# EAGLE design controller_rev2 (EAGLE 9.0.0)

## Sheet 1 of 3
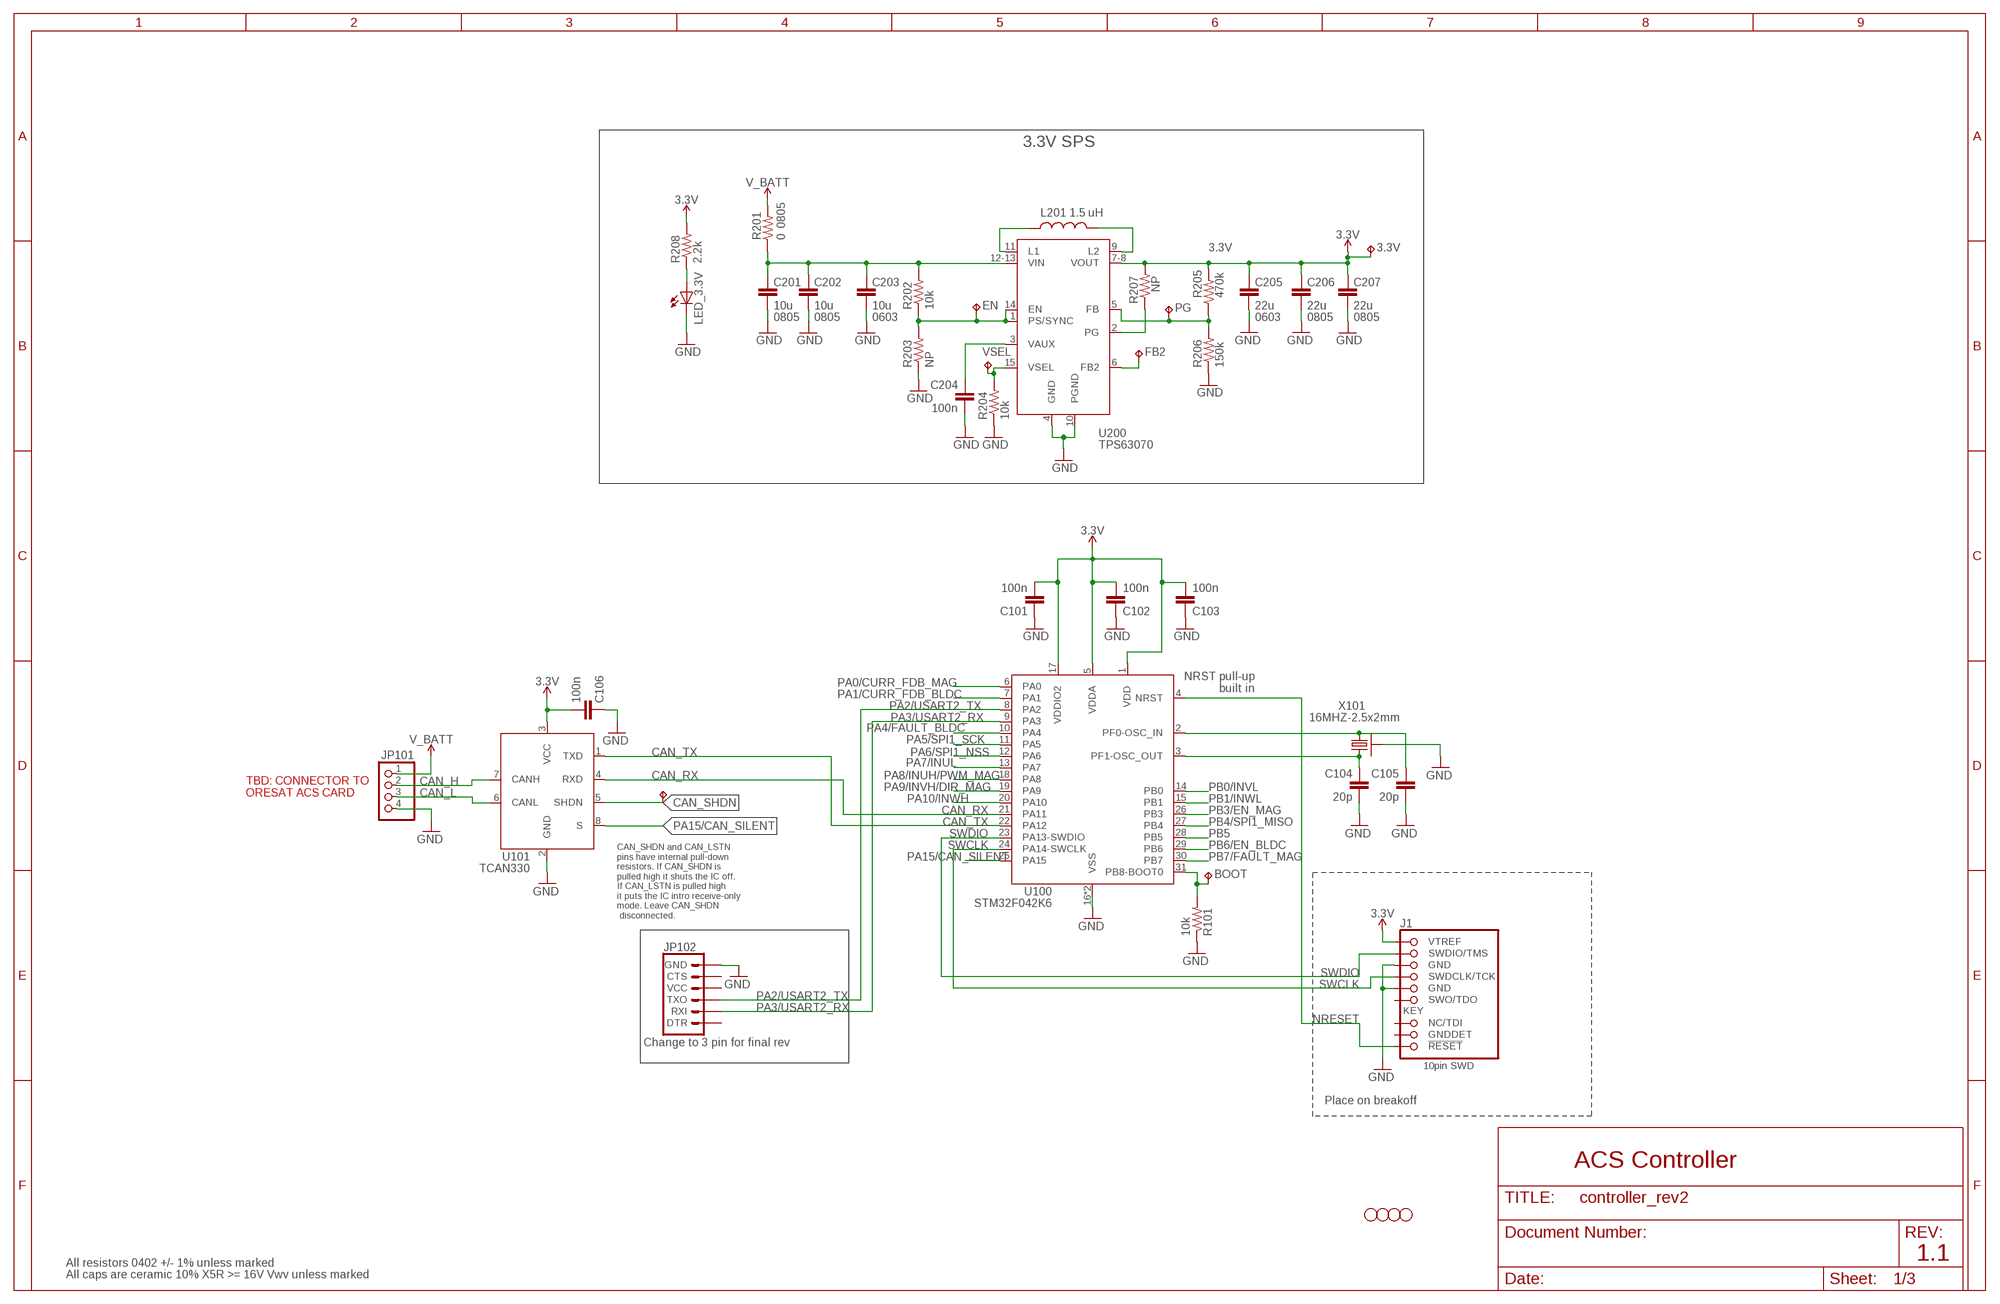
[diagram p0: schematic, sheet 1]

### Parts
3.3V  TPTP15SQ  [TP15SQ]
BOOT  TPTP15SQ  [TP15SQ]
BOOT1  TPTP15SQ  [TP15SQ]
C101  100n  C-EU0402-B-NOSILK  [.0402-B-NOSILK]
C102  100n  C-EU0402-B-NOSILK  [.0402-B-NOSILK]
C103  100n  C-EU0402-B-NOSILK  [.0402-B-NOSILK]
C104  20p  C-EU0402-B-NOSILK  [.0402-B-NOSILK]
C105  20p  C-EU0402-B-NOSILK  [.0402-B-NOSILK]
C106  100n  C-EU0402-B-NOSILK  [.0402-B-NOSILK]
C201  10u  C-EU0805-B-NOSILK  [.0805-B-NOSILK]
C202  10u  C-EU0805-B-NOSILK  [.0805-B-NOSILK]
C203  10u  C-EU0603-B-NOSILK  [.0603-B-NOSILK]
C204  100n  C-EU0402-B-NOSILK  [.0402-B-NOSILK]
C205  22u  C-EU0603-B-NOSILK  [.0603-B-NOSILK]
C206  22u  C-EU0805-B-NOSILK  [.0805-B-NOSILK]
C207  22u  C-EU0805-B-NOSILK  [.0805-B-NOSILK]
EN  TPTP15SQ  [TP15SQ]
FB2  TPTP15SQ  [TP15SQ]
H1  STAND-OFFTIGHT  [STAND-OFF-TIGHT]
H2  STAND-OFFTIGHT  [STAND-OFF-TIGHT]
H3  STAND-OFFTIGHT  [STAND-OFF-TIGHT]
H4  STAND-OFFTIGHT  [STAND-OFF-TIGHT]
J1  1.27MM-SWD-CONNECTOR  [1.27MM_2X5]
JP101  PINHD-1X4  [1X04]
JP102  6_PIN_SERIAL_TARGETSILK  [6_PIN_SERIAL_TARGET_SIDE_W_SILK]
L201  1.5 uH  L-COILCRAFT-XFL4020  [L-COILCRAFT-XFL4020]
LED_3.3V  LEDCHIPLED_0603  [CHIPLED_0603]
PG  TPTP15SQ  [TP15SQ]
R101  10k  R-US_0402-B-NOSILK  [.0402-B-NOSILK]
R201  0  R-US_0805-B-NOSILK  [.0805-B-NOSILK]
R202  10k  R-US_0402-B-NOSILK  [.0402-B-NOSILK]
R203  NP  R-US_0402-B-NOSILK  [.0402-B-NOSILK]
R204  10k  R-US_0402-B-NOSILK  [.0402-B-NOSILK]
R205  470k  R-US_0402-B-NOSILK  [.0402-B-NOSILK]
R206  150k  R-US_0402-B-NOSILK  [.0402-B-NOSILK]
R207  NP  R-US_0402-B-NOSILK  [.0402-B-NOSILK]
R208  2.2k  R-US_0603-B-NOSILK  [.0603-B-NOSILK]
U100  STM32F042K6  [QFP32-7X7]
U101  TCAN330  [SOT23-8_TI-DCN]
U200  TPS63070  TPS63070X  [TPS63070X]
VSEL  TPTP15SQ  [TP15SQ]
X101  16MHZ-2.5x2mm  CRYSTAL-WITH-GND  [CRYSTAL_2.5X2]

### Nets
3.3V: 3.3V.TP C101.2 C102.2 C103.2 C106.2 C205.1 C206.1 C207.1 J1.VTREF R205.2 R207.2 R208.2 U100.1(VDD) U100.5(VDDA) U100.17(VDDIO2) U101.3(VCC) U200.7-8(VOUT) ; also sheet 2,3
BOOT: BOOT.TP R101.2 U100.31(PB8-BOOT0)
CAN_H: JP101.2 U101.7(CANH)
CAN_L: JP101.3 U101.6(CANL)
CAN_RX: U100.21(PA11) U101.4(RXD)
CAN_SHDN: BOOT1.TP U101.5(SHDN)
CAN_TX: U100.22(PA12) U101.1(TXD)
CRYSTALIN: C105.1 U100.2(PF0-OSC_IN) X101.1
CRYSTALOUT: C104.1 U100.3(PF1-OSC_OUT) X101.3
GND: C101.1 C102.1 C103.1 C104.2 C105.2 C106.1 C201.2 C202.2 C203.2 C204.2 C205.2 C206.2 C207.2 J1.GND J1.GND@2(GND) JP101.4 JP102.P$6(GND) LED_3.3V.C R101.1 R203.1 R204.1 R206.1 U100.16(VSS) U100.32(VSS) U101.2(GND) U200.4(GND) U200.10(PGND) X101.2(SHIELD) X101.4(SHIELD) ; also sheet 2,3
N$20: LED_3.3V.A R208.1
NRESET: J1.!RESET U100.4(NRST)
PA0/CURR_FDB_MAG: U100.6(PA0) ; also sheet 3
PA1/CURR_FDB_BLDC: U100.7(PA1) ; also sheet 2
PA2/USART2_TX: JP102.P$2(TXO) U100.8(PA2)
PA3/USART2_RX: JP102.P$3(RXI) U100.9(PA3)
PA4/FAULT_BLDC: U100.10(PA4) ; also sheet 2
PA5/SPI1_SCK: U100.11(PA5) ; also sheet 2
PA6/SPI1_NSS: U100.12(PA6) ; also sheet 2
PA7/INUL: U100.13(PA7) ; also sheet 2
PA8/INUH/PWM_MAG: U100.18(PA8) ; also sheet 2,3
PA9/INVH/DIR_MAG: U100.19(PA9) ; also sheet 2,3
PA10/INWH: U100.20(PA10) ; also sheet 2
PA15/CAN_SILENT: U100.25(PA15) U101.8(S)
PB0/INVL: U100.14(PB0) ; also sheet 2
PB1/INWL: U100.15(PB1) ; also sheet 2
PB3/EN_MAG: U100.26(PB3) ; also sheet 3
PB4/SPI1_MISO: U100.27(PB4) ; also sheet 2
PB5: U100.28(PB5)
PB6/EN_BLDC: U100.29(PB6) ; also sheet 2
PB7/FAULT_MAG: U100.30(PB7) ; also sheet 3
SWCLK: J1.SWDCLK(SWDCLK/TCK) U100.24(PA14-SWCLK)
SWDIO: J1.SWDIO(SWDIO/TMS) U100.23(PA13-SWDIO)
TPS-EN: EN.TP R202.1 R203.2 U200.1(PS/SYNC) U200.14(EN)
TPS-FB: PG.TP R205.1 R206.2 U200.5(FB)
TPS-L1: L201.1 U200.11(L1)
TPS-L2: L201.2 U200.9(L2)
TPS-PG: R207.1 U200.2(PG)
TPS-VAUX: C204.1 U200.3(VAUX)
TPS-VIN: C201.1 C202.1 C203.1 R201.1 R202.2 U200.12-13(VIN)
TSP-FB2: FB2.TP U200.6(FB2)
TSP-VSEL: R204.2 U200.15(VSEL) VSEL.TP
V_BATT: JP101.1 R201.2 ; also sheet 2,3
Unconnected: J1.GNDDET J1.NC(NC/TDI) J1.SWO(SWO/TDO) JP102.P$1(DTR) JP102.P$4(VCC) JP102.P$5(CTS)

### Notes on the sheet
- 3.3V SPS
- 0805
- 0805 | 0805 | 0603 | 0603 | 0805 | 0805
- NRST pull-up
  built in
- TBD: CONNECTOR TO 
  ORESAT ACS CARD
- CAN_SHDN and CAN_LSTN
  pins have internal pull-down
  resistors. If CAN_SHDN is 
  pulled high it shuts the IC off.
  If CAN_LSTN is pulled high
  it puts the IC intro receive-only
  mode. Leave CAN_SHDN
   disconnected.
- Change to 3 pin for final rev
- Place on breakoff
- ACS Controller
- 1.1
- All resistors 0402 +/- 1% unless marked
- All caps are ceramic 10% X5R >= 16V Vwv unless marked

## Sheet 2 of 3
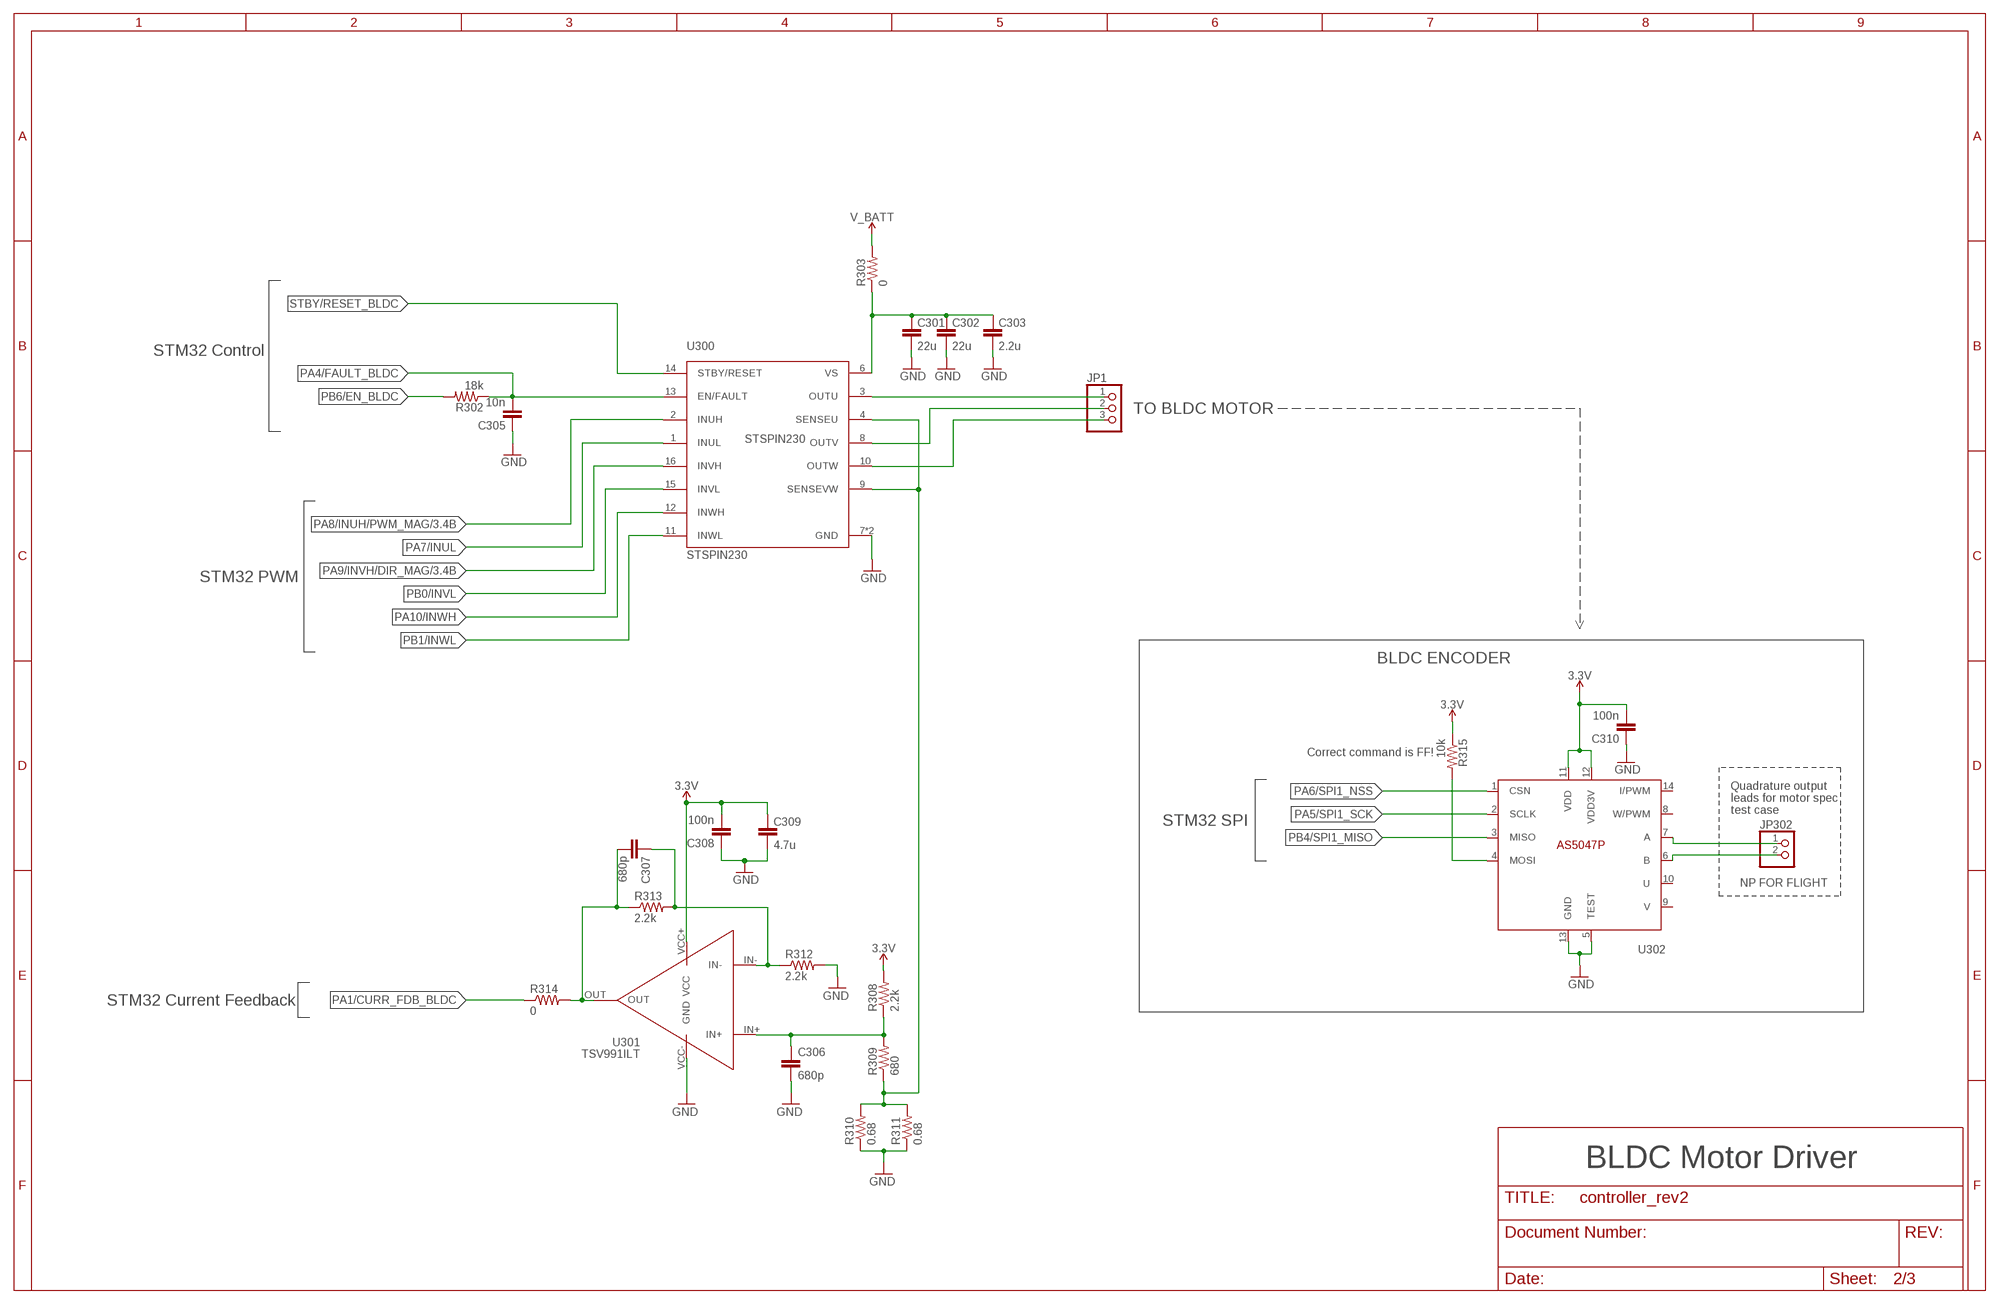
[diagram p1: schematic, sheet 2]

### Parts
C301  22u  C-EU0603-B-NOSILK  [.0603-B-NOSILK]
C302  22u  C-EU0603-B-NOSILK  [.0603-B-NOSILK]
C303  2.2u  C-EU0603-B-NOSILK  [.0603-B-NOSILK]
C305  10n  C-EU0402-B-NOSILK  [.0402-B-NOSILK]
C306  680p  C-EU0402-B-NOSILK  [.0402-B-NOSILK]
C307  680p  C-EU0402-B-NOSILK  [.0402-B-NOSILK]
C308  100n  C-EU0402-B-NOSILK  [.0402-B-NOSILK]
C309  4.7u  C-EU0603-B-NOSILK  [.0603-B-NOSILK]
C310  100n  C-EU0402-B-NOSILK  [.0402-B-NOSILK]
JP1  PINHD-1X3  [1X03]
JP302  PINHD-1X2  [1X02]
R302  18k  R-US_0402-B-NOSILK  [.0402-B-NOSILK]
R303  0  R-US_0805-B-NOSILK  [.0805-B-NOSILK]
R308  2.2k  R-US_0402-B-NOSILK  [.0402-B-NOSILK]
R309  680  R-US_0402-B-NOSILK  [.0402-B-NOSILK]
R310  0.68  R-US_0805-B-NOSILK  [.0805-B-NOSILK]
R311  0.68  R-US_0805-B-NOSILK  [.0805-B-NOSILK]
R312  2.2k  R-US_0402-B-NOSILK  [.0402-B-NOSILK]
R313  2.2k  R-US_0402-B-NOSILK  [.0402-B-NOSILK]
R314  0  R-US_0402-B-NOSILK  [.0402-B-NOSILK]
R315  10k  R-US_0402-B-NOSILK  [.0402-B-NOSILK]
U300  STSPIN230  [VFQFPN]
U301  TSV991ILT  [SOT23-5]
U302  AS5047P  [TSSOP14]

### Nets
3.3V: C308.2 C309.1 C310.2 R308.2 R315.1 U301.VCC+(VCC) U302.11(VDD) U302.12(VDD3V) ; also sheet 1,3
GND: C301.2 C302.2 C303.2 C305.1 C306.2 C308.1 C309.2 C310.1 R310.1 R311.1 R312.2 U300.7(GND) U300.EPAD(GND) U301.VCC-(GND) U302.5(TEST) U302.13(GND) ; also sheet 1,3
N$1: R315.2 U302.4(MOSI)
N$4: JP302.1 U302.7(A)
N$7: C301.1 C302.1 C303.1 R303.1 U300.6(VS)
N$13: JP302.2 U302.6(B)
N$14: C307.1 R312.1 R313.2 U301.IN-
N$16: C306.1 R308.1 R309.2 U301.IN+
N$29: C307.2 R313.1 R314.2 U301.OUT
PA1/CURR_FDB_BLDC: R314.1 ; also sheet 1
PA4/FAULT_BLDC: C305.2 R302.1 U300.13(EN/FAULT) ; also sheet 1
PA5/SPI1_SCK: U302.2(SCLK) ; also sheet 1
PA6/SPI1_NSS: U302.1(CSN) ; also sheet 1
PA7/INUL: U300.1(INUL) ; also sheet 1
PA8/INUH/PWM_MAG: U300.2(INUH) ; also sheet 1,3
PA9/INVH/DIR_MAG: U300.16(INVH) ; also sheet 1,3
PA10/INWH: U300.12(INWH) ; also sheet 1
PB0/INVL: U300.15(INVL) ; also sheet 1
PB1/INWL: U300.11(INWL) ; also sheet 1
PB4/SPI1_MISO: U302.3(MISO) ; also sheet 1
PB6/EN_BLDC: R302.2 ; also sheet 1
SENSE_BLDC: R309.1 R310.2 R311.2 U300.4(SENSEU) U300.9(SENSEVW)
STBY/RESET_BLDC: U300.14(STBY/RESET)
U: JP1.1 U300.3(OUTU)
V: JP1.2 U300.8(OUTV)
V_BATT: R303.2 ; also sheet 1,3
W: JP1.3 U300.10(OUTW)
Unconnected: U302.8(W/PWM) U302.9(V) U302.10(U) U302.14(I/PWM)

### Notes on the sheet
- STM32 Control
- TO BLDC MOTOR
- STM32 PWM
- BLDC ENCODER
- Correct command is FF!
- Quadrature output
  leads for motor spec
  test case
- STM32 SPI
- NP FOR FLIGHT
- STM32 Current Feedback
- BLDC Motor Driver

## Sheet 3 of 3
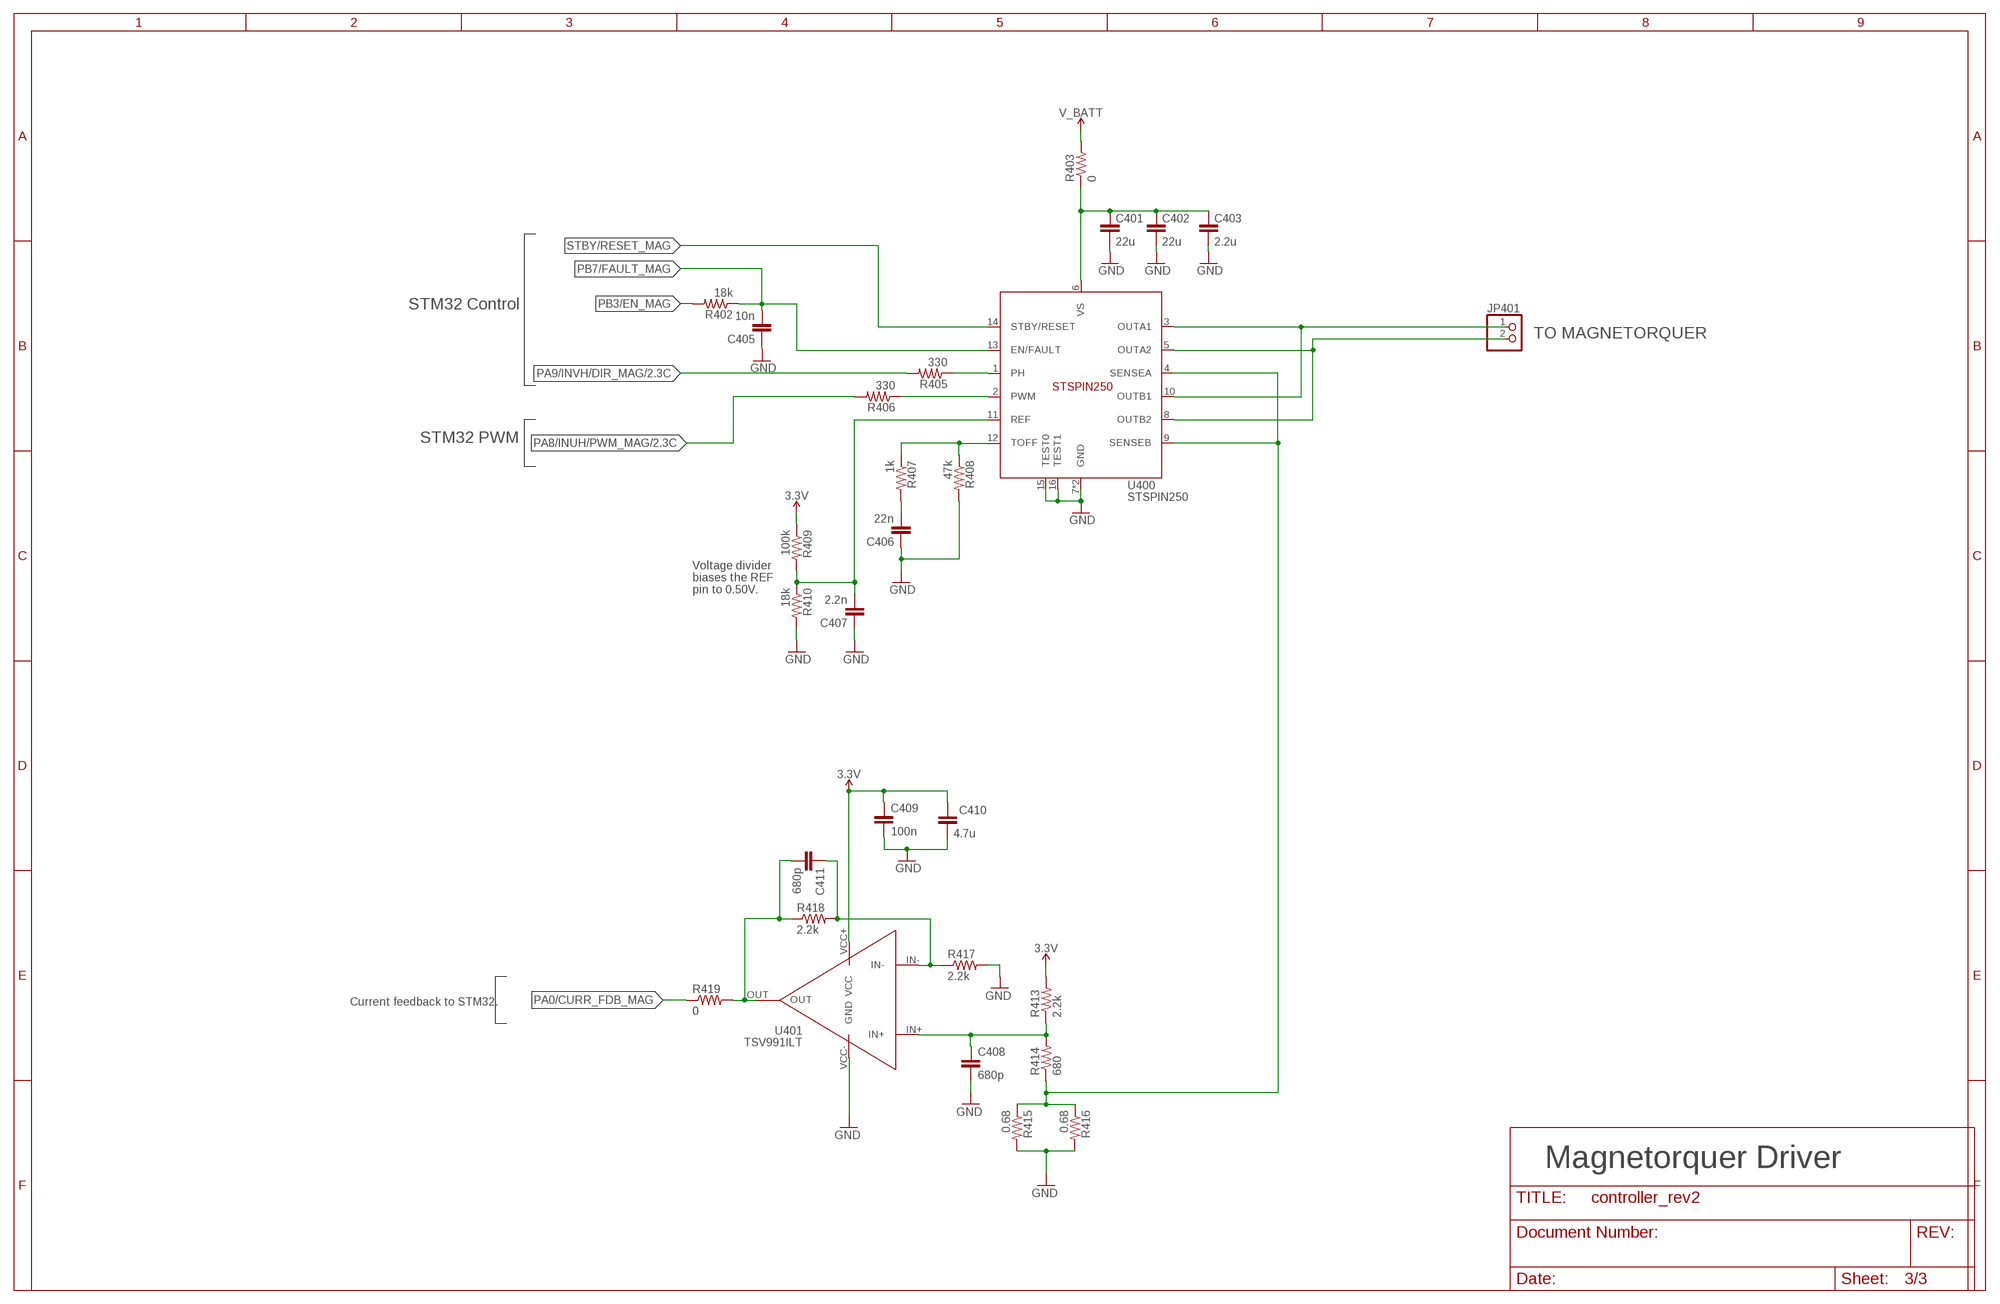
[diagram p2: schematic, sheet 3]

### Parts
C401  22u  C-EU0603-B-NOSILK  [.0603-B-NOSILK]
C402  22u  C-EU0603-B-NOSILK  [.0603-B-NOSILK]
C403  2.2u  C-EU0603-B-NOSILK  [.0603-B-NOSILK]
C405  10n  C-EU0402-B-NOSILK  [.0402-B-NOSILK]
C406  22n  C-EU0402-B-NOSILK  [.0402-B-NOSILK]
C407  2.2n  C-EU0402-B-NOSILK  [.0402-B-NOSILK]
C408  680p  C-EU0402-B-NOSILK  [.0402-B-NOSILK]
C409  100n  C-EU0402-B-NOSILK  [.0402-B-NOSILK]
C410  4.7u  C-EU0603-B-NOSILK  [.0603-B-NOSILK]
C411  680p  C-EU0402-B-NOSILK  [.0402-B-NOSILK]
JP401  PINHD-1X2  [1X02]
R402  18k  R-US_0402-B-NOSILK  [.0402-B-NOSILK]
R403  0  R-US_0805-B-NOSILK  [.0805-B-NOSILK]
R405  330  R-US_0402-B-NOSILK  [.0402-B-NOSILK]
R406  330  R-US_0402-B-NOSILK  [.0402-B-NOSILK]
R407  1k  R-US_0402-B-NOSILK  [.0402-B-NOSILK]
R408  47k  R-US_0402-B-NOSILK  [.0402-B-NOSILK]
R409  100k  R-US_0402-B-NOSILK  [.0402-B-NOSILK]
R410  18k  R-US_0402-B-NOSILK  [.0402-B-NOSILK]
R413  2.2k  R-US_0402-B-NOSILK  [.0402-B-NOSILK]
R414  680  R-US_0402-B-NOSILK  [.0402-B-NOSILK]
R415  0.68  R-US_0805-B-NOSILK  [.0805-B-NOSILK]
R416  0.68  R-US_0805-B-NOSILK  [.0805-B-NOSILK]
R417  2.2k  R-US_0402-B-NOSILK  [.0402-B-NOSILK]
R418  2.2k  R-US_0402-B-NOSILK  [.0402-B-NOSILK]
R419  0  R-US_0402-B-NOSILK  [.0402-B-NOSILK]
U400  STSPIN250  [VFQPN]
U401  TSV991ILT  [SOT23-5]

### Nets
3.3V: C409.1 C410.1 R409.1 R413.2 U401.VCC+(VCC) ; also sheet 1,2
GND: C401.2 C402.2 C403.2 C405.1 C406.1 C407.1 C408.2 C409.2 C410.2 R408.2 R410.2 R415.2 R416.2 R417.2 U400.7(GND) U400.15(TEST0) U400.16(TEST1) U400.EPAD(GND) U401.VCC-(GND) ; also sheet 1,2
N$2: C406.2 R407.2
N$3: R406.1 U400.2(PWM)
N$5: R405.1 U400.1(PH)
N$8: C401.1 C402.1 C403.1 R403.1 U400.6(VS)
N$15: C408.1 R413.1 R414.2 U401.IN+
N$17: C411.1 R417.1 R418.2 U401.IN-
N$19: R407.1 R408.1 U400.12(TOFF)
N$25: C407.2 R409.2 R410.1 U400.11(REF)
N$27: C411.2 R418.1 R419.2 U401.OUT
OUT1: JP401.1 U400.3(OUTA1) U400.10(OUTB1)
OUT2: JP401.2 U400.5(OUTA2) U400.8(OUTB2)
PA0/CURR_FDB_MAG: R419.1 ; also sheet 1
PA8/INUH/PWM_MAG: R406.2 ; also sheet 1,2
PA9/INVH/DIR_MAG: R405.2 ; also sheet 1,2
PB3/EN_MAG: R402.2 ; also sheet 1
PB7/FAULT_MAG: C405.2 R402.1 U400.13(EN/FAULT) ; also sheet 1
SENSE_MAG: R414.1 R415.1 R416.1 U400.4(SENSEA) U400.9(SENSEB)
STBY/RESET_MAG: U400.14(STBY/RESET)
V_BATT: R403.2 ; also sheet 1,2

### Notes on the sheet
- STM32 Control
- TO MAGNETORQUER
- STM32 PWM
- Voltage divider
  biases the REF
  pin to 0.50V.
- Current feedback to STM32.
- Magnetorquer Driver

## Library data of the parts
3.3V BOOT BOOT1 EN FB2 PG VSEL = testpad:TP: Test pad
C101-C103 C106 C204 C305-C308 C310 C405-C409 C411 = rcl_custom:C-EU: CAPACITOR, European symbol; DIS: Digi-Key; DPN: 1276-1001-1-ND; MFR: Samsung; MPN: CL05B104KO5NNNC
C104 C105 = rcl_custom:C-EU: CAPACITOR, European symbol; DIS: Digi-Key; DPN: 1276-6601-1-ND; MFR: Samsung; MPN: CL05C200JB51PNC
C201 C202 C206 C207 = oresat-rcl:C-EU: CAPACITOR, European symbol
C203 C205 C301-C303 C309 C401-C403 C410 = oresat-rcl:C-EU: CAPACITOR, European symbol; DIS: Digi-Key; DPN: 1276-1001-1-ND; MFR: Samsung; MPN: CL05B104KO5NNNC
H1-H4 = SparkFun-Hardware:STAND-OFF: Stand Off Drill holes for mechanically mounting via screws, standoffs, etc. Note: Use the keepout ring to avoid running the screw head into surrounding components. Variant Overviews STAND-OFF - Mechanical footprint for a #4 phillips button head screw. STAND-OFF-TIGHT - Mechanical footprint for a #4 phillips button head screw, Example SparkFun Products Screw - Phillips Head (1/4", 4-40, 10 pack) <https://www.sparkfun.com/products/10453> (PRT-10453) Screw - Phillips Head (1/2", 4-40, 10 pack) <https://www.sparkfun.com/products/10452> (PRT-10452) Screw - Phillips Head (3/4", 4-40, 10 pack) <https://www.sparkfun.com/products/10451> (PRT-10451) Screw - Phillips Head (1", 4-40, 10 pack) <https://www.sparkfun.com/products/10450> (PRT-10450)
J1 = J-CNC-3220-10-0100-00-ARM-SWD-port:1.27MM-SWD-CONNECTOR: ARM SWD Programming Header. Example part is the CNC 3220-10-0100-00
JP1 = pinhead:PINHD-1X3: PIN HEADER
JP101 = pinhead:PINHD-1X4: PIN HEADER
JP102 = SparkFun-Connectors:6_PIN_SERIAL_TARGET: 6-pin header connection for use with the "FTDI BASIC" pinout - TARGET SIDE. Also known as "Arduino Serial Program Header". It is used to mate with our FTDI Basic serial programmers using the Arduino IDE. Note, this device has "TARGET" in the name. It is intended to be used on a design that contains a target micro-controller that you wish to program. The "sister" device, named "CABLE" is inteneded to be used on a design that usually lives on the end of your USB cable and prvides the converter chip (FTDI232 or FTDI231x) to commnicate serial RX/TX. You can populate with some of these: Break Away Headers - Straight <https://www.sparkfun.com/products/116> (PRT-00116) For reference (or to suit your programming needs) check out these designs: SparkFun FTDI Basic Breakout - 5V <https://www.sparkfun.com/products/9716> (DEV-09716) SparkFun FTDI Basic Breakout - 3.3V <https://www.sparkfun.com/products/9873> (DEV-09873) SparkFun FTDI SmartBasic <https://www.sparkfun.com/products/12935> (DEV-12935) SparkFun Beefy 3 - FTDI Basic Breakout <https://www.sparkfun.com/products/13746> (DEV-13746)
JP302 JP401 = pinhead:PINHD-1X2: PIN HEADER
L201 = L-Coilcraft-XFL4020:L-COILCRAFT-XFL4020; DIS: Mouser; DPN: 994-XFL4020-152MEB; MFR: Coilcraft; MPN: XFL4020-152ME
LED_3.3V = led:LED: LED OSRAM: - CHIPLED LG R971, LG N971, LY N971, LG Q971, LY Q971, LO R971, LY R971 LH N974, LH R974 LS Q976, LO Q976, LY Q976 LO Q996 - Hyper CHIPLED LW Q18S LB Q993, LB Q99A, LB R99A - SideLED LS A670, LO A670, LY A670, LG A670, LP A670 LB A673, LV A673, LT A673, LW A673 LH A674 LY A675 LS A676, LA A676, LO A676, LY A676, LW A676 LS A679, LY A679, LG A679 - Hyper Micro SIDELED® LS Y876, LA Y876, LO Y876, LY Y876 LT Y87S - SmartLED LW L88C, LW L88S LB L89C, LB L89S, LG L890 LS L89K, LO L89K, LY L89K LS L896, LA L896, LO L896, LY L896 - TOPLED LS T670, LO T670, LY T670, LG T670, LP T670 LSG T670, LSP T670, LSY T670, LOP T670, LYG T670 LG T671, LOG T671, LSG T671 LB T673, LV T673, LT T673, LW T673 LH T674 LS T676, LA T676, LO T676, LY T676, LB T676, LH T676, LSB T676, LW T676 LB T67C, LV T67C, LT T67C, LS T67K, LO T67K, LY T67K, LW E67C LS E67B, LA E67B, LO E67B, LY E67B, LB E67C, LV E67C, LT E67C LW T67C LS T679, LY T679, LG T679 LS T770, LO T770, LY T770, LG T770, LP T770 LB T773, LV T773, LT T773, LW T773 LH T774 LS E675, LA E675, LY E675, LS T675 LS T776, LA T776, LO T776, LY T776, LB T776 LHGB T686 LT T68C, LB T68C - Hyper Mini TOPLED® LB M676 - Mini TOPLED Santana® LG M470 LS M47K, LO M47K, LY M47K Source: http://www.osram.convergy.de LUXEON: - LUMILED® LXK2-PW12-R00, LXK2-PW12-S00, LXK2-PW14-U00, LXK2-PW14-V00 LXK2-PM12-R00, LXK2-PM12-S00, LXK2-PM14-U00 LXK2-PE12-Q00, LXK2-PE12-R00, LXK2-PE12-S00, LXK2-PE14-T00, LXK2-PE14-U00 LXK2-PB12-K00, LXK2-PB12-L00, LXK2-PB12-M00, LXK2-PB14-N00, LXK2-PB14-P00, LXK2-PB14-Q00 LXK2-PR12-L00, LXK2-PR12-M00, LXK2-PR14-Q00, LXK2-PR14-R00 LXK2-PD12-Q00, LXK2-PD12-R00, LXK2-PD12-S00 LXK2-PH12-R00, LXK2-PH12-S00 LXK2-PL12-P00, LXK2-PL12-Q00, LXK2-PL12-R00 Source: www.luxeon.com KINGBRIGHT: KA-3528ASYC Source: www.kingbright.com
R101 R202-R207 R302 R308 R309 R312-R315 R402 R405-R410 R413 R414 R417-R419 = rcl_custom:R-US_: RESISTOR, American symbol; DIS: Digi-Key; DPN: 1276-4275-1-ND; MFR: Samsung; MPN: RC1005F6653CS
R201 = rcl_custom:R-US_: RESISTOR, American symbol; DIS: Digi-Key; DPN: RHM0.0ARCT-ND; MFR: Rohm; MPN: MCR10EZPJ000
R208 R303 R310 R311 R403 R415 R416 = oresat-rcl:R-US_: RESISTOR, American symbol
U100 = STM32F042K:STM32F042K6; DIS: Digi-Key; DPN: STM32F042K6T7-ND; MFR: STMicroelectronics; MPN: STM32F042K6T7
U101 = TCAN330:TCAN330; DIS: Digi-Key; DPN: 296-44211-1-ND; MFR: Texas Instruments; MPN: TCAN330GDCNT
U200 = ic-pwr-tps63070x:TPS63070X: TPS63070 2-V to 16-V Buck-Boost Converter With 3.6-A Switch Current
U300 = U-ST-STSPIN230-BLDC-controller:STSPIN230
U301 U401 = TSV991ILT:TSV991ILT
U302 = U-AMS-AS5047P-encoder:AS5047P
U400 = U-ST-STSPIN250-Brushed-DC-controller:STSPIN250
X101 = low-gain-radio:CRYSTAL-WITH-GND; DIS: Digi-Key; DPN: XC2181CT-ND; MFR: ECS Inc.; MPN: ECS-160-10-36Q-ES-TR

## Board
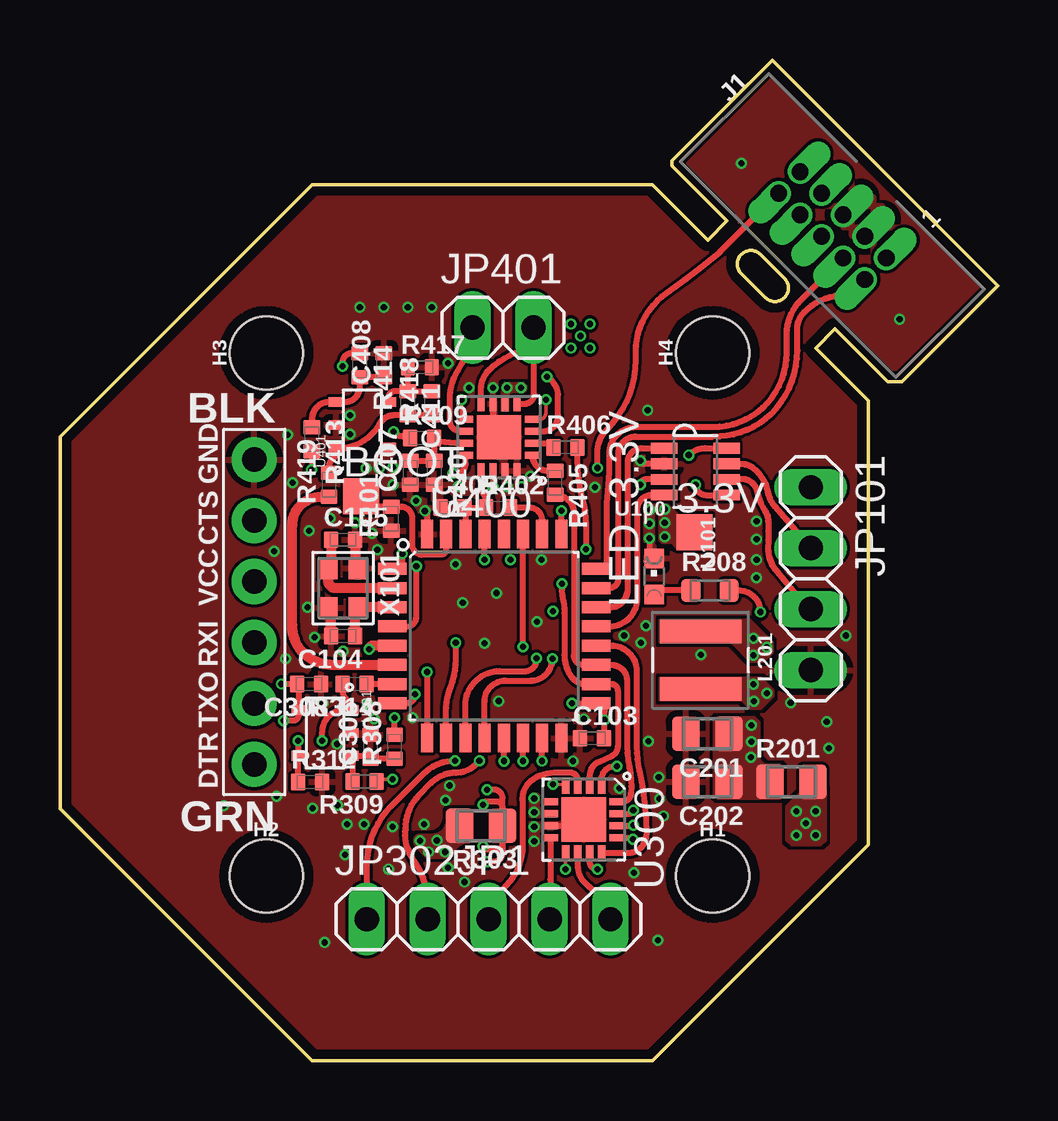
[diagram p3: board, top side]
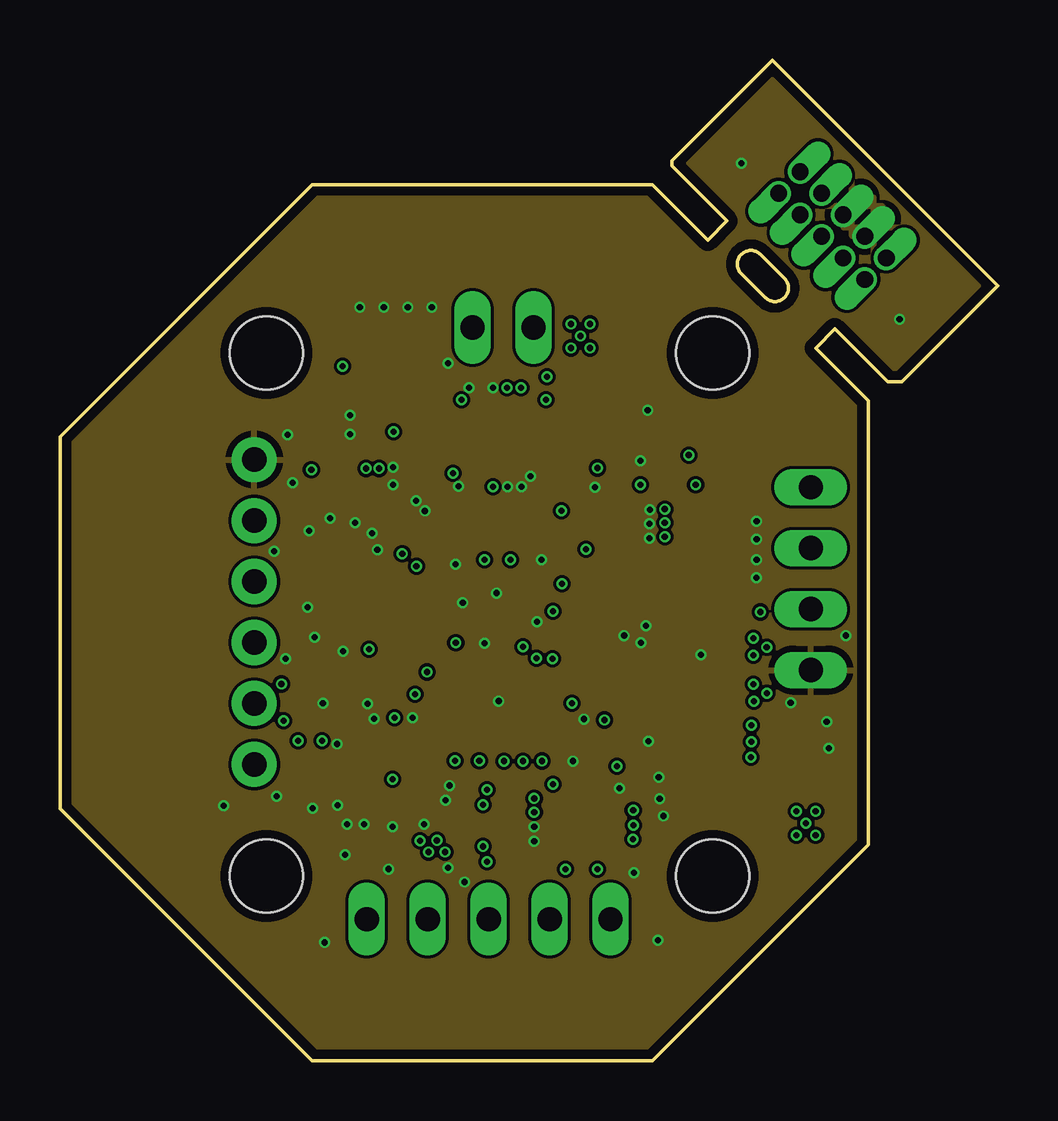
[diagram p4: board, inner layer Route2]
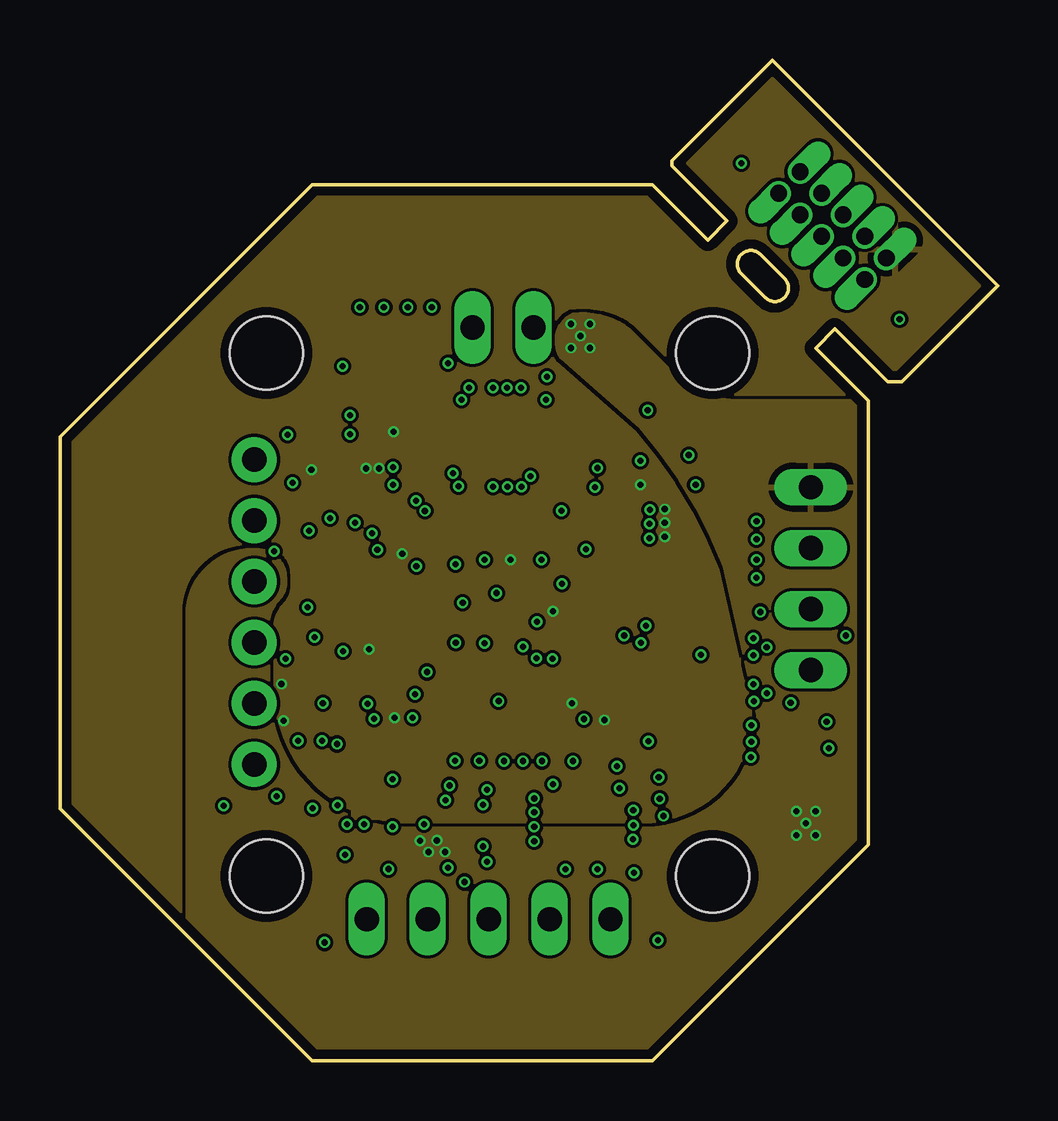
[diagram p5: board, inner layer Route15]
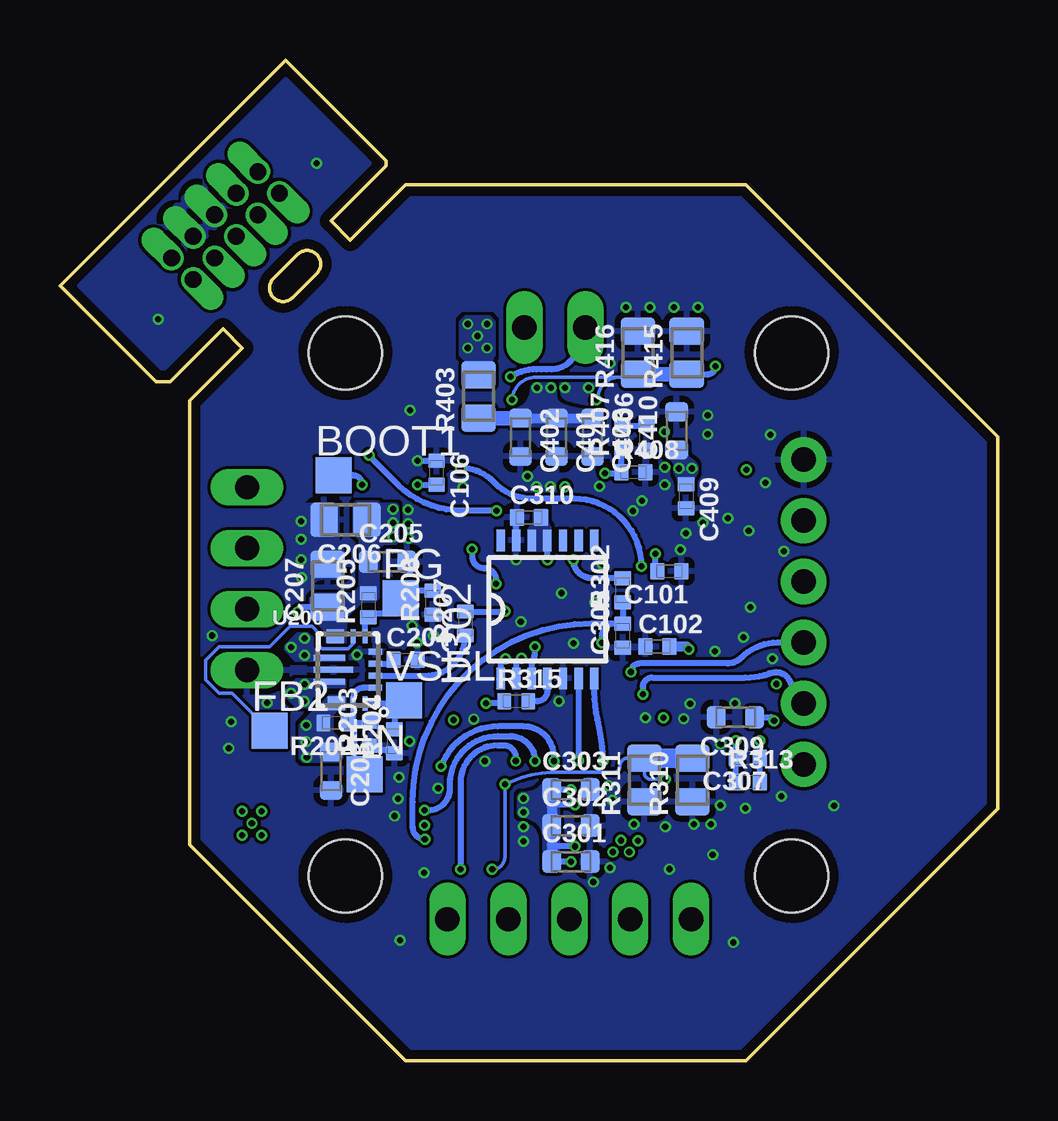
[diagram p6: board, bottom side, seen from below]

Size 39.1 x 41.7 mm. Coordinates in mm from the lower left corner, seen from the top.
Outline: 33.7,9 33.7,27.5 31.5,29.7 32.3,30.5 34.5,28.3 35.1,28.3 39.1,32.3 29.7,41.7 25.5,37.5 25.5,37.3 27.8,35 27,34.2 24.7,36.5 10.5,36.5 0,26 0,10.5 10.5,0 24.7,0 33.7,9
Outline: 29.2,33.6 30.2,32.6 arc-180 29.4,31.8 28.4,32.8 arc-180 29.2,33.6
Copper layers (1*2*15*16): Top 0.035559375mm / dielectric 0.17018125mm / Route2 0.01778125mm / dielectric 47mil / Route15 0.01778125mm / dielectric 0.17018125mm / Bottom 0.035559375mm
Design rules "oshpark-4layer-tented": minimum track width 5mil, minimum drill 10mil, track to track 5mil, track to pad 5mil, pad to pad 5mil, via to via 5mil, smd to smd 5mil, copper to edge 15mil, drill to drill 6mil, minimum pad ring 4mil, minimum via ring 4mil, stop-mask expansion 2.5mil, vias tented up to drill 20mil, thermal gap 10mil

### Footprints (pad centres in the part's own frame; a part is rotated, then mirrored left to right if it is on the bottom)
TP15SQ = smd 1.5 x 1.5: TP 0,0
.0402-B-NOSILK = smd 0.6 x 0.7: 1 -0.5,0; 2 0.5,0
.0805-B-NOSILK = smd 1.15 x 1.45: 1 -0.9,0; 2 0.9,0
.0603-B-NOSILK = smd 0.8 x 0.95: 1 -0.8,0; 2 0.8,0
STAND-OFF-TIGHT = hole 3.048: 0,0
1.27MM_2X5 = drill 0.7 pad 1.016 offset: !RESET 0.635,-2.54; GND -0.635,1.27; GND@2 -0.635,0; GNDDET -0.635,-2.54; KEY -0.635,-1.27; NC 0.635,-1.27; SWDCLK 0.635,1.27; SWDIO 0.635,2.54; SWO 0.635,0; VTREF -0.635,2.54
1X03 = drill 1.016 long: 1 -2.54,0; 2 0,0; 3 2.54,0
1X04 = drill 1.016 long: 1 -3.81,0; 2 -1.27,0; 3 1.27,0; 4 3.81,0
6_PIN_SERIAL_TARGET_SIDE_W_SILK = drill 1.016 pad 1.88: P$1 -6.35,0; P$2 -3.81,0; P$3 -1.27,0; P$4 1.27,0; P$5 3.81,0; P$6 6.35,0
1X02 = drill 1.016 long: 1 -1.27,0; 2 1.27,0
L-COILCRAFT-XFL4020 = smd 0.98 x 3.4: 1 -1.2,0; 2 1.2,0
CHIPLED_0603 = smd 0.8 x 0.8: A 0,-0.75; C 0,0.75
QFP32-7X7 = smd 1.2 x 0.5: 1 -4.25,2.8; 2 -4.25,2; 3 -4.25,1.2; 4 -4.25,0.4; 5 -4.25,-0.4; 6 -4.25,-1.2; 7 -4.25,-2; 8 -4.25,-2.8; 17 4.25,-2.8; 18 4.25,-2; 19 4.25,-1.2; 20 4.25,-0.4; 21 4.25,0.4; 22 4.25,1.2; 23 4.25,2; 24 4.25,2.8 | smd 0.5 x 1.2: 9 -2.8,-4.25; 10 -2,-4.25; 11 -1.2,-4.25; 12 -0.4,-4.25; 13 0.4,-4.25; 14 1.2,-4.25; 15 2,-4.25; 16 2.8,-4.25; 25 2.8,4.25; 26 2,4.25; 27 1.2,4.25; 28 0.4,4.25; 29 -0.4,4.25; 30 -1.2,4.25; 31 -2,4.25; 32 -2.8,4.25
SOT23-8_TI-DCN = smd 0.45 x 1.1: 1 -0.975,-1.3; 2 -0.325,-1.3; 3 0.325,-1.3; 4 0.975,-1.3; 5 0.975,1.3; 6 0.325,1.3; 7 -0.325,1.3; 8 -0.975,1.3
TPS63070X = smd 0.6 x 0.25: 1 -1.15,0.75; 2 -1.15,0.25; 3 -1.15,-0.25; 4 -1.15,-0.75 | smd 0.25 x 0.6: 5 -0.725,-1.4; 6 -0.225,-1.4; 14 -0.225,1.4; 15 -0.725,1.4 | smd 0.75 x 0.6: 7-8 0.525,-1.4; 12-13 0.475,1.4 | smd 1.35 x 0.25: 9 0.775,-0.5; 11 0.775,0.5 | smd 1.7 x 0.25: 10 0.6,0
VFQFPN = smd 0.63 x 0.3: 1 -1.39,0.75; 2 -1.39,0.25; 3 -1.39,-0.25; 4 -1.39,-0.75; 9 1.39,-0.75; 10 1.39,-0.25; 11 1.39,0.25; 12 1.39,0.75 | smd 0.3 x 0.63: 5 -0.75,-1.39; 6 -0.25,-1.39; 7 0.25,-1.39; 8 0.75,-1.39; 13 0.75,1.39; 14 0.25,1.39; 15 -0.25,1.39; 16 -0.75,1.39 | smd 1.85 x 1.85: EPAD 0,0
SOT23-5 = smd 0.4 x 0.6: IN+ 0.95,1.1; IN- 0.95,-1.1; OUT -0.95,1.1; VCC+ -0.95,-1.1; VCC- 0,1.1
TSSOP14 = smd 0.9 x 0.35: 1 -2.875,1.95; 2 -2.875,1.3; 3 -2.875,0.65; 4 -2.875,0; 5 -2.875,-0.65; 6 -2.875,-1.3; 7 -2.875,-1.95; 8 2.875,-1.95; 9 2.875,-1.3; 10 2.875,-0.65; 11 2.875,0; 12 2.875,0.65; 13 2.875,1.3; 14 2.875,1.95
VFQPN = smd 0.63 x 0.3: 1 -1.39,0.75; 2 -1.39,0.25; 3 -1.39,-0.25; 4 -1.39,-0.75; 9 1.39,-0.75; 10 1.39,-0.25; 11 1.39,0.25; 12 1.39,0.75 | smd 0.3 x 0.63: 5 -0.75,-1.39; 6 -0.25,-1.39; 7 0.25,-1.39; 8 0.75,-1.39; 13 0.75,1.39; 14 0.25,1.39; 15 -0.25,1.39; 16 -0.75,1.39 | smd 1.85 x 1.85: EPAD 0,0
CRYSTAL_2.5X2 = smd 0.9 x 0.8: 1 -0.825,-0.625; 2 0.825,-0.625; 3 0.825,0.625; 4 -0.825,0.625

### Placement (x,y rotation side)
3.3V  26.44,22.03 0 top
BOOT  12.55,23.53 0 top
BOOT1  27.7,24.4 0 bottom
C101  13.7,20.4 180 bottom
C102  14.19,17.26 0 bottom
C103  22.18,13.44 0 top
C104  11.8,17.7 180 top
C105  11.8,21.71 0 top
C106  23.4,24.5 270 bottom
C201  26.99,13.62 180 top
C202  26.99,11.62 180 top
C203  27.8,12.07 270 bottom
C204  24.69,16.71 0 bottom
C205  25.44,20.79 0 bottom
C206  27.19,22.54 180 bottom
C207  27.94,19.79 90 bottom
C301  17.8,8.3 0 bottom
C302  17.8,9.8 0 bottom
C303  17.8,11.3 0 bottom
C305  15.64,17.71 90 bottom
C306  12.95,13.09 90 top
C307  10.43,12.62 180 bottom
C308  10.39,15.7 180 top
C309  10.94,14.32 180 bottom
C310  19.55,22.64 0 bottom
C401  18.4,25.98 270 bottom
C402  19.9,25.98 270 bottom
C403  16.9,25.98 270 bottom
C405  16.37,23.05 0 top
C406  14.65,25.97 90 bottom
C407  14.6,24.5 90 top
C408  13.5,28.99 90 top
C409  13,23.52 270 bottom
C410  13.39,26.24 90 bottom
C411  14.5,27.4 270 top
EN  26.4,11.94 0 bottom
FB2  30.36,13.76 0 bottom
H1  27.2,7.7 0 top
H2  8.6,7.7 0 top
H3  8.6,29.5 90 top
H4  27.2,29.5 90 top
J1  32.2,34.8 225 top
JP1  20.41,5.9 0 top
JP101  31.3,20.09 270 top
JP102  8.1,18.7 90 top
JP302  14.06,5.9 0 top
JP401  18.47,30.55 0 top
L201  26.7,16.69 90 top
LED_3.3V  24.77,20.18 0 top
PG  24.9,19.27 0 bottom
R101  13.81,22.59 90 top
R201  30.49,11.62 0 top
R202  27.62,14.08 180 bottom
R203  26.16,13.63 90 bottom
R204  25.16,13.32 90 bottom
R205  26.24,18.99 90 bottom
R206  23.56,19.08 90 bottom
R207  22.2,18.22 90 bottom
R208  27.1,19.6 0 top
R302  15.64,19.61 90 bottom
R303  17.55,9.8 180 top
R308  13.95,13.09 90 top
R309  12.69,11.64 180 top
R310  12.74,11.7 90 bottom
R311  14.74,11.7 90 bottom
R312  10.43,11.62 0 top
R313  10.43,11.62 0 bottom
R314  12.29,15.7 180 top
R315  20.08,14.98 0 bottom
R402  18.27,23.05 0 top
R403  21.65,27.68 90 bottom
R405  20.64,24.09 270 top
R406  21.07,25.56 0 top
R407  15.65,25.97 90 bottom
R408  15.2,24.52 0 bottom
R409  15.1,25.95 0 top
R410  15.6,24.5 270 top
R413  10.5,25.9 270 top
R414  12.5,28.99 270 top
R415  12.97,29.5 90 bottom
R416  15,29.5 90 bottom
R417  15,28.9 0 top
R418  15.5,27.4 90 top
R419  11.22,24 90 top
U100  18.1,17.7 0 top
U101  26.49,24.55 270 top
U200  27.1,16.29 180 bottom
U300  21.83,10.05 270 top
U301  11.05,13.66 270 top
U302  18.78,18.81 90 bottom
U400  18.3,25.98 180 top
U401  12.6,26.5 90 top
VSEL  24.75,15.02 0 bottom
X101  11.8,19.7 270 top

### Tracks (layer width: path | path; a pad name or v marks a point on that pad's centre or on a via)
3.3V  (via drill 0.25)
  Top 0.254: v13.91,26.21 arc90 14.56,26.12 R409.1 | v21.34,14.9 U100.17 arc-90 22.7,14.55 v22.7,14.2 22.7,13.46 arc-90 C103.2 | v14.27,21.12 14.27,20.5 U100.1 | R413.2 10.5,24.63 v10.48,24.63 | R308.2 v13.95,14.29 | v9.23,15.7 C308.2 arc-90 9.95,15.64 U301.VCC+ 9.95,14.42 arc-90 9.7,14.17 v9.33,14.17 | U101.3 24.43,24.23 arc90 v24.2,24 | R208.2 28.3,19.6 arc-90 v29.2,18.7
  Top 0.406: U100.5 13.05,17.3 arc90 v12.89,17.14
  Bottom 0.254: R315.1 arc90 20.66,14.9 v21.34,14.9 | v18.78,20.88 U302.11 | C101.2 arc45 14.27,20.57 v14.27,21.12 | C309.1 9.48,14.32 arc90 v9.33,14.17 | v24.2,24 C106.2 | R207.2 v20.55,18.72 arc-90 v20.55,18.73 | v29.2,18.7 arc90 29.01,18.89 C207.1
  Bottom 0.406: v12.89,17.14 arc-90 13.01,17.26 C102.2
  other vias: 12.76,24.68 13.3,24.68 25.21,21.84 25.21,22.42 25.21,22.99
  pour Bottom (no thermals): 19.55,21.28 19.55,22.06 arc56 19.45,22.25 arc-54 19.32,22.49 19.32,22.94 18.79,22.94 18.79,22.46 arc-40 18.74,22.31 arc48 18.67,22.1 18.67,21.28
  pour Bottom (no thermals): 13.17,25.78 arc90 12.96,25.57 12.96,25.29 arc-67 12.8,25.05 arc106 12.63,24.39 arc-41 12.72,24.11 12.72,23.79 13.29,23.79 13.29,24.05 arc-35 13.4,24.4 arc42 13.5,24.8 arc-81 13.7,25.1 arc79 13.81,25.26 13.81,25.63 arc90 13.66,25.78
  pour Top (no thermals): 13.43,25.72 13.43,25.5 arc-90 12.79,24.86 12.76,24.86 arc90 12.59,24.69 arc90 12.78,24.5 13.29,24.5 arc90 13.48,24.69 arc-69 13.78,25.13 arc66 13.93,25.34 13.93,25.72
  pour Bottom (no thermals): 27.97,17.81 28.65,18.49 28.65,19.28 28.49,19.44 26.89,19.44 26.6,19.73 26.6,21.74 26.84,21.98 26.84,23.19 26.75,23.28 25.84,23.28 25.74,23.18 25.08,23.18 25,23.1 25,21.69 25.12,21.57 25.62,21.57 25.84,21.35 25.84,19.29 25.98,19.15 26.53,19.15 27.2,18.48 27.2,17.43 27.24,17.39 27.97,17.39
  pour Top (no thermals): 27.1,22.7 25.8,22.7 25.3,23.2 25.1,23.2 25,23.1 25,21.7 25.1,21.6 25.5,21.6 25.7,21.4 27.1,21.4
  pour Route15 (rank 6): 0,42 40,42 40,0 0,0
BOOT
  Top 0.254: U100.31 16.1,21.32 arc-90 15.88,21.09 15.1,21.09 arc-90 14.68,21.51 14.68,22.63 arc90 14.22,23.09 R101.2 12.99,23.09 arc-90 BOOT.TP
CAN_H
  Top 0.152: 31.3,21.48 JP101.2
  Top 0.254: U101.7 28.43,24.87 arc-39 28.9,24.7 arc-39 29.5,23.7 arc31 29.8,23.1 arc-2 JP101.2
CAN_L
  Top 0.254: U101.6 28.39,24.25 arc-80 29.06,23.73 arc20 29.4,22.89 arc-32 29.53,22.44 arc-1 29.52,21.33 arc40 29.8,20.5 arc7 JP101.3
CAN_RX
  Top 0.254: U100.21 22.9,18.1 arc90 24.07,19.27 24.07,22.97 arc-90 24.68,23.57 U101.4
CAN_SHDN  (via drill 0.25)
  Top 0.254: v26.5,24 arc90 26.93,23.57 U101.5
  Bottom 0.254: BOOT1.TP 26.9,24.4 arc90 v26.5,24
CAN_TX
  Top 0.254: U100.22 22.93,18.9 arc90 23.67,19.64 23.67,24.94 arc-90 24.25,25.52 U101.1
CRYSTALIN
  Top 0.406: U100.2 11.47,19.7 arc-90 11.18,19.99 X101.1 arc90 11.3,20.65 C105.1
CRYSTALOUT
  Top 0.406: U100.3 12.45,18.9 | 12.45,18.9 X101.3 | C104.1 12.3,18.75 arc-90 12.45,18.9
GND  (via drill 0.25)
  Top 0.254: U400.7 18.05,26.23 U400.EPAD | U300.7 21.58,9.8 arc90 U300.EPAD | U101.2 24.32,24.88 arc-90 v24.2,25 | v24.57,21.78 24.57,21.13 LED_3.3V.C | v15.21,22.91 15.3,22.82 U100.32
  Top 0.406: C105.2 12.3,20.65 arc90 X101.4 | C104.2 11.3,18.75 arc90 X101.2
  Bottom 0.254: U302.13 20.08,22.64 C310.1 | v24.2,25 C106.1 | R203.1 26.16,12.96 25.14,12.96 R204.1
  other vias: 12.1,26.9 12.1,26.1 18.65,23.92 19.24,23.92 19.61,24.35 20.08,20.88 13.01,21.98 13.89,24.73 13.89,24 12.3,22.42 14.84,23.34 16.61,23.94 13.23,21.29 11.26,22.6 21.85,14.24 21.39,12.49 18.29,14.99 12.83,14.87 18.05,28.04 16.18,29.07 15.5,31.4 14.5,31.4 13.5,31.4 12.5,31.4 19.77,9.75 19.77,9.15 13.1,14.26 11.56,13.2 10.96,14.9 16.24,11.47 16.07,10.85 16.17,8.05 16.87,7.45 15.17,9.85 13.87,9.75 12.67,9.85 11.97,9.85 11.57,10.65 11.8,17.06 10.61,17.65 10.32,18.89 17.69,17.39 18.19,19.49 16.49,20.69 14.69,14.29 17.06,28.04 9.4,16.76 25.15,10.2 25,10.92 24.96,11.82 24.22,17.42 26.72,16.92 23.52,17.72 24.42,18.12 23.33,11.35 24.53,13.31 22.3,23.9 24.59,22.96 24.58,22.38 29.04,22.48 29.04,21.73 29.04,20.88 29.03,20.13 11.89,8.59 13.69,7.99 16.79,19.09 19.89,18.29 10.39,22.09 9.69,24.09 9.49,26.09 8.93,21.23 9.03,11.03 10.53,10.53 6.83,10.63 23.93,7.83 24.93,5.03 11.03,4.93 30.46,14.92 31.96,14.12 32.06,13.02 32.76,17.72 24.5,27.1 35,30.9 28.4,37.4
  pour Top (rank 2, no thermals): 20.7,9.9 19.6,9.9 19.6,8.9 19.9,8.9 20,9 20,9.7 20.7,9.7
  pour Bottom (no thermals): 27.7,23.2 28.7,23.2 arc-90 29.4,22.5 29.4,20.1 arc-90 29.1,19.8 28.84,19.8 arc-45 28.6,19.9 arc46 28.1,20.1 27.5,20.1 arc-90 27.3,20.3 27.3,21.16 arc-45 27.4,21.4 arc45 27.5,21.64 27.5,23 arc-90
  pour Route2 (rank 6): 0,0 40,0 40,42 0,42
  pour Bottom (rank 6): 0,0 40,0 40,42 0,42
  pour Top (rank 6): 0,0 40,0 40,42 0,42
N$1
  Bottom 0.254: U302.4 18.78,15.41 arc90 19.21,14.98 R315.2
N$2
  Bottom 0.254: R407.2 C406.2
N$3
  Top 0.254: U400.2 20.4,25.73 arc-90 R406.1
N$4  (via drill 0.25)
  Top 0.254: v16.46,12.49 arc45 15.15,11.95 13.8,10.6 arc45 12.79,8.16 JP302.1
  Bottom 0.254: U302.7 16.83,15.36 arc-13 16.7,14.2 arc10 v16.46,12.49
N$5
  Top 0.254: U400.1 arc90 20.33,24.59 R405.1
N$7  (via drill 0.25)
  Top 0.254: R303.1 18.45,10.55 | 18.45,10.55 arc90 18.2,10.8 17.76,10.8 arc90 v17.63,10.67 | R303.1 18.45,9.05 arc-90 18.2,8.8 17.76,8.8 arc-90 v17.63,8.93 | 18.45,10.55 18.45,10.94 arc90 18.09,11.3 v17.8,11.3 | R303.1 18.44,8.64 arc-90 18.1,8.3 v17.8,8.3
  Bottom 0.254: v17.8,11.3 C303.1 | v17.63,8.93 arc-90 v17.63,8.93 18.53,8.93 18.6,9 | v17.8,8.3 C301.1 | v17.63,10.67 18.53,10.67 18.6,10.6
  Bottom 0.406: C303.1 18.6,10.6 C302.1 18.6,9 C301.1
  other vias: 19.77,10.35 19.77,10.93
  pour Bottom (no thermals): 18.31,11.61 18.31,8.03 arc90 18.42,7.92 18.8,7.92 arc90 18.92,8.04 18.92,9.29 arc-90 19.79,10.16 arc90 19.99,10.36 19.99,10.95 arc90 19.79,11.15 19.78,11.15 arc-52 18.93,11.56 arc90 18.79,11.7 18.4,11.7 arc90
  pour Top (no thermals): 20.7,10.4 20.1,10.4 20,10.5 20,11 19.9,11.1 19.7,11.1 19.6,11 19.6,10.2 19.7,10.1 19.9,10.1 20,10.2 20.7,10.2
N$8  (via drill 0.25)
  Bottom 0.406: C402.1 C401.1 C403.1
  Bottom 0.61: R403.1 C402.1
  other vias: 18.63,28.04 19.22,28.04
  pour Bottom (no thermals): 18.6,28.24 19.2,28.24 arc-90 19.44,27.96 arc76 20.2,27.1 arc-90 20.3,26.96 20.3,26.56 arc-90 20.1,26.46 16.6,26.46 arc-90 16.5,26.6 16.5,27 arc-90 16.6,27.1 arc23 18.1,27.3 arc73 18.45,27.76 18.45,27.96 arc-90
  pour Top (no thermals): 18.45,27.09 18.45,28.04 arc-90 18.63,28.22 19.23,28.22 arc-90 19.41,28.04 arc-90 19.24,27.87 18.84,27.87 arc90 18.65,27.68 18.65,27.09
N$13  (via drill 0.25)
  Top 0.254: v17.48,12.49 17.33,12.34 arc-45 16.5,12 arc45 15.48,11.58 14.95,11.05 arc45 14.4,9.7 arc45 14.72,8.38 arc-36 15.3,6.8 JP302.2
  Bottom 0.254: U302.6 v17.48,12.49
N$14  (via drill 0.25)
  Top 0.254: R312.1 9.93,12.69 | 9.93,12.69 U301.IN- | v9.93,13.33 9.93,12.69
  Bottom 0.254: R312.1 C307.1 v9.93,13.33
N$15
  Top 0.254: R413.1 10.5,26.73 arc-90 11.22,27.45 U401.IN+ 11.88,27.45 arc90 12.5,28.07 R414.2 C408.1
N$16
  Top 0.254: R308.1 C306.1 arc45 12.66,12.71 U301.IN+ arc-45 12.19,12.61 R309.2
N$17
  Top 0.254: C411.1 R417.1 | C411.1 R418.2 | U401.IN- 13.7,27.65 arc-90 13.95,27.9 C411.1
N$19  (via drill 0.25)
  Top 0.254: U400.12 16.91,24.89 arc-90 16.5,24.48 v16.38,24.48
  Bottom 0.254: 15.78,24.6 arc90 R408.1 | R408.1 15.7,25.42 arc90 R407.1 | v16.38,24.48 15.74,24.48 arc-90 R408.1
N$20
  Top 0.254: R208.1 25.09,19.6 LED_3.3V.A
N$25
  Top 0.152: U400.11 17.14,25.73
  Top 0.254: C407.2 R410.1 15.6,25.8 | R409.2 15.65,25.85 arc90 15.6,25.8 | U400.11 arc-7 16.25,25.76 arc8 15.6,25.8
N$27
  Top 0.254: R418.1 C411.2 14,26.9 arc67 13.3,26.5 arc-61 11.5,25.5 arc-3 U401.OUT 11.5,25.35 arc-45 11.36,25.07 arc45 11.22,24.79 R419.2
N$29  (via drill 0.25)
  Top 0.254: v10.93,13.33 10.93,13.71 arc-90 11.83,14.61 12,14.61 | U301.OUT 12,14.61 | R314.2 11.79,15.37 arc45 11.9,15.1 arc-45 12,14.86 12,14.61
  Bottom 0.254: R313.1 C307.2 v10.93,13.33
NRESET  (via drill 0.25)
  Top 0.254: U100.4 14.44,18.1 14.44,18.09 arc90 14.86,18.51 v14.86,20.61 | J1.!RESET 27.51,33.71 arc-45 27.5,33.7 arc-5 25.3,32 arc55 24,29.5 24,29.2 arc-45 22.8,26.3 arc45 22.4,25.33 v22.4,24.7
  Bottom 0.254: v14.86,20.61 arc-90 17.67,23.42 19.42,23.42 arc45 20.96,24.06 21.03,24.13 arc-45 v22.4,24.7
OUT1  (via drill 0.25)
  Top 0.254: 16.65,26.23 U400.10 16.69,26.23 arc-90 16.25,26.67 16.25,27.55 arc-32 16.6,28.78 arc24 JP401.1 | U400.3 20.16,26.23 arc90 20.77,26.91 20.77,27.77 arc51 v20.31,28.5
  Bottom 0.254: JP401.1 17.61,29.48 arc67 18.61,28.81 arc0 19.24,28.81 arc-33 v20.31,28.5
OUT2
  Top 0.254: 17.55,27.2 U400.8 17.55,27.97 arc-46 17.9,28.8 arc-28 19.24,29.58 arc89 JP401.2 arc-90 19.77,30.44 19.77,27.79 arc-90 19.35,27.37 U400.5
PA0/CURR_FDB_MAG
  Top 0.406: U100.6 11.3,16.5 arc-90 9.68,18.16 9.68,22.31 arc-90 10.87,23.5 R419.1
PA1/CURR_FDB_BLDC
  Top 0.254: U100.7 R314.1
PA2/USART2_TX  (via drill 0.25)
  Top 0.254: U100.8 14.44,14.9 arc90 v14.81,15.27
  Bottom 0.254: JP102.P$2 arc21 8.64,15.72 arc-32 8.88,16.08 arc-44 9.36,16.18 arc-7 9.55,16.13 arc18 10.54,15.97 14.41,15.97 arc-90 14.81,15.57 v14.81,15.27
PA3/USART2_RX  (via drill 0.25)
  Top 0.254: v15.3,16.2 U100.9
  Bottom 0.254: JP102.P$3 9.18,17.43 arc-45 10.7,16.8 arc45 11.29,16.55 14.95,16.55 arc-90 v15.3,16.2
PA4/FAULT_BLDC  (via drill 0.25)
  Top 0.254: U300.13 23.82,9.3 arc-90 v23.89,9.23 | U100.10 16.09,14.46 arc-22 16.3,15.6 arc22 16.5,16.71 v16.5,17.42
  Bottom 0.254: v23.89,9.23 arc90 24.4,9.74 24.4,10.79 arc90 16.96,18.23 15.98,18.23 | 15.98,18.23 15.66,18.23 | 15.66,18.23 arc90 C305.2 | v16.5,17.42 16.5,17.71 arc90 15.98,18.23 | R302.1 15.64,18.25 arc90 15.66,18.23
PA5/SPI1_SCK  (via drill 0.25)
  Top 0.254: U100.11 16.9,14.8 arc-90 18.34,16.24 19.45,16.24 arc90 v19.87,16.77
  Bottom 0.254: v19.87,16.77 arc-90 20.08,16.5 U302.2
PA6/SPI1_NSS  (via drill 0.25)
  Top 0.254: U100.12 17.7,14.97 arc-90 18.57,15.84 19.62,15.84 arc90 v20.53,16.75
  Bottom 0.254: v20.53,16.75 arc-90 20.73,16.55 U302.1
PA7/INUL  (via drill 0.25)
  Top 0.254: v18.51,12.49 arc-90 v18.5,12.5 18.5,12.8 U100.13 | U300.1 22.58,11.73 arc-90 23.12,12.27 v23.22,12.27
  Bottom 0.254: v18.51,12.49 18.51,12.67 arc-90 19.77,13.93 20.84,13.93 arc-70 v23.22,12.27
PA8/INUH/PWM_MAG  (via drill 0.25)
  Top 0.254: 22.47,15.7 U100.18 arc-20 21.79,15.7 arc-35 21.42,15.89 arc-21 21.18,16.23 arc-25 21.03,16.91 21.03,18.65 arc9 20.99,19.15 arc-6 v20.92,19.87 | R406.2 21.56,25.05 arc17 21.77,23.42 arc-16 21.92,22.34 v21.92,21.32 | 22.45,15.72 arc-90 22.47,15.7 | U300.2 22.08,11.83 arc-68 22.45,12.45 23.03,12.72 arc61 23.25,13.09 23.25,15.43 arc90 22.98,15.7 22.47,15.7
  Bottom 0.254: v21.92,21.32 21.92,21.03 arc-90 21.42,20.53 arc90 20.92,20.03 v20.92,19.87
PA9/INVH/DIR_MAG
  Top 0.254: R405.2 arc-90 21.42,22.81 21.42,16.9 arc90 21.82,16.5 U100.19 22.94,16.5 arc-90 23.64,15.87 23.64,13.11 arc12 23.73,12.23 arc-15 23.81,11.16 arc-90 23.45,10.8 U300.16
PA10/INWH
  Top 0.254: U100.20 22.96,17.3 arc-90 24.04,16.25 24.04,13.07 arc13 24.15,12.07 arc-12 24.45,9.43 arc-90 23.68,8.66 U300.12
PA15/CAN_SILENT  (via drill 0.25)
  Top 0.254: U100.25 v20.9,22.92 | v26.21,25.24 arc-45 26.9,25.52 U101.8
  Bottom 0.254: v20.9,22.92 22.34,22.92 arc45 25,24 26.19,25.19 arc45 v26.21,25.24
PB0/INVL  (via drill 0.25)
  Top 0.254: U300.15 arc-90 U300.15 23.76,10.3 arc90 v23.9,10.44 | v19.3,12.49 U100.14
  Bottom 0.254: v19.3,12.49 arc-90 20.34,13.53 20.85,13.53 arc-90 22.84,11.54 22.84,11.35 arc90 23.75,10.44 v23.9,10.44
PB1/INWL  (via drill 0.25)
  Top 0.254: v20.1,12.49 U100.15 | v22.4,7.99 arc-90 22.08,8.31 U300.11
  Bottom 0.254: v20.1,12.49 20.1,12.65 arc-90 20.59,13.14 20.87,13.14 arc-90 22.4,11.61 v22.4,7.99
PB3/EN_MAG
  Top 0.254: U100.26 20.1,22.52 arc90 19.57,23.05 R402.2
PB4/SPI1_MISO  (via drill 0.25)
  Top 0.254: v19.3,17.25 U100.27
  Bottom 0.254: U302.3 19.43,16.44 arc24 19.39,16.63 arc-25 19.3,17.08 v19.3,17.25
PB6/EN_BLDC  (via drill 0.25)
  Top 0.254: v17.7,20.88 U100.29
  Bottom 0.254: R302.2 16.93,20.11 arc90 v17.7,20.88
PB7/FAULT_MAG
  Top 0.254: 17.63,23.05 C405.2 arc-90 16.9,23.02 U100.30 arc-90 16.87,21.98 | 17.63,23.05 R402.1 | U400.13 17.55,23.92 arc38 17.65,23.63 arc-80 17.63,23.05
SENSE_BLDC  (via drill 0.25)
  Top 0.152: R309.1 arc-90 13.28,11.73 v13.86,11.73 | U300.9 v21.08,7.97 | v20.55,11.52 21.08,11.51 U300.4
  Bottom 0.152: v13.86,11.73 14.47,11.73 arc90 14.74,12 R311.2 15.24,12.6 arc90 15.25,12.61 15.44,12.61 arc-90 15.75,12.3 arc90 16.03,12.02 18.24,12.02 arc-28 v20.55,11.52 20.55,8.5 arc90 v21.08,7.97
  Bottom 0.813: R311.2 R310.2
SENSE_MAG  (via drill 0.25)
  Top 0.152: U400.9 16.73,26.73 v16.73,27.55 | v20.25,27.54 20.25,26.98 arc-90 20,26.73 U400.4
  Top 0.254: R414.1 12.18,29.49 arc90 11.78,29.09 v11.78,28.94
  Bottom 0.152: R416.1 arc90 15.12,28.48 15.8,28.48 | 15.8,28.48 19.26,28.48 arc-87 v20.25,27.54 | v16.73,27.55 16.68,27.55 arc90 15.8,28.48
  Bottom 0.254: R415.1 12.12,28.6 arc-90 v11.78,28.94
  Bottom 0.61: R416.1 R415.1 arc90 R415.1
STBY/RESET_BLDC  (via drill 0.25)
  Top 0.254: U300.14 23.88,9.8 arc90 v23.9,9.82
STBY/RESET_MAG  (via drill 0.25)
  Top 0.254: U400.14 v18.05,23.91 arc90 v18.04,23.92
SWCLK
  Top 0.254: U100.24 22.8,20.5 22.8,23.22 22.9,24.52 22.9,25.3 arc-90 24.01,26.41 27.22,26.41 arc90 30.3,29.49 30.3,30.28 arc-45 30.89,31.69 J1.SWDCLK
SWDIO
  Top 0.254: U100.23 22.9,19.7 arc90 23.28,20.08 23.28,25.29 arc-90 24,26.01 27.21,26.01 arc45 29.64,26.94 arc45 30.74,29.6 30.73,30.48 arc-45 31.03,31.2 arc-45 32.69,31.9 32.9,31.9 arc6 J1.SWDIO
TPS-EN
  Bottom 0.254: R202.1 26.88,14.32 U200.14 26.88,15.13 arc90 26.47,15.54 U200.1 | R202.1 26.21,14.08 R203.2 | R202.1 26.85,13.81 26.85,12.23 26.7,12.23 EN.TP
TPS-FB
  Bottom 0.254: U200.5 26.38,18.36 arc90 R205.1 arc90 26.08,18.65 25.09,18.65 arc-90 24.9,18.84 PG.TP arc90 24.59,19.58 R206.2
TPS-L1  (via drill 0.25)
  other vias: 28.92,14.98 28.91,15.69 29.47,15.32
  pour Bottom (no thermals): 27.25,15.87 29.23,15.87 29.71,15.39 29.71,15.23 29.24,14.76 28.8,14.76 28.65,14.91 28.65,15.1 28.16,15.59 27.24,15.59 27.24,15.86
  pour Top (no thermals): 25.03,15.95 29.22,15.95 29.72,15.45 29.72,15.19 29.22,14.69 28.78,14.69 28.42,15.05 25.03,15.05
TPS-L2  (via drill 0.25)
  other vias: 28.91,16.89 28.9,17.6 29.46,17.23
  pour Bottom (no thermals): 27.25,16.7 29.27,16.7 29.7,17.13 29.7,17.29 29.19,17.8 28.77,17.8 28.59,17.62 28.59,17.3 28.16,16.87 27.25,16.87
  pour Top (no thermals): 25.04,18.35 28.76,18.35 29.67,17.44 29.67,17.01 29.31,16.65 28.79,16.65 28,17.44 25.04,17.44
TPS-PG
  Bottom 0.254: U200.2 23.88,16.04 arc-90 R207.1
TPS-VAUX
  Bottom 0.254: U200.3 25.36,16.54 arc-90 C204.1
TPS-VIN  (via drill 0.25)
  other vias: 28.83,13.98 28.83,13.3 28.81,12.64
  pour Bottom (no thermals): 27.21,15.18 27.21,14.65 27.22,14.64 27.54,14.64 27.76,14.42 27.76,13.66 27.36,13.26 27.36,12.61 27.48,12.49 28.97,12.49 29.09,12.61 29.09,13.98 27.87,15.18
  pour Top (no thermals): 27.4,14.3 28.95,14.3 29.14,14.11 29.14,12.54 29.37,12.31 30.01,12.31 30.11,12.21 30.11,11.04 30.01,10.94 27.44,10.94 27.29,11.09 27.29,14.19
TSP-FB2
  Bottom 0.152: U200.6 26.88,17.38 27.09,17.16 28.16,17.16 28.3,17.3 28.3,17.8 28.6,18.1 29.5,18.1 30.36,17.25 32.46,17.25 33.03,16.68 33.03,15.88 32.46,15.31 31.91,15.31 FB2.TP
TSP-VSEL
  Bottom 0.254: U200.15 24.75,14.89 VSEL.TP 25.14,15.02 R204.2
U
  Top 0.254: U300.3 21.58,11.7 | 21.58,11.7 21.58,11.71 | 21.58,11.7 arc90 21.27,12.01 20.75,12.01 arc33 19.73,11.73 arc61 19.28,10.87 19.28,8.95 arc-45 18.6,7.3 arc35 JP1.1
V
  Top 0.254: U300.8 20.44,7.55 arc-2 JP1.2
V_BATT  (via drill 0.25)
  other vias: 15.71,9.18 15.37,8.7 16.05,8.7 15.01,9.17 21.3,29.7 21.7,30.2 21.3,30.7 22.1,29.7 22.1,30.7 31.5,10.4 30.7,10.4 31.1,9.9 31.5,9.4 30.7,9.4
  pour Top (no thermals): 16.31,10.47 17.04,10.47 arc-90 17.18,10.33 17.18,9.3 arc-90 17.01,9.13 arc45 16.6,8.96 16.19,8.55 arc-45 16.05,8.49 15.42,8.49 arc-45 15.2,8.58 14.93,8.85 arc-45 14.79,9.19 arc-90 15,9.4 15.5,9.4 arc90 16.15,10.05 16.15,10.31 arc-90
  pour Top (no thermals): 31,12.2 31,11.3 30.3,10.6 30.3,9.2 30.5,9 31.7,9 31.9,9.2 31.9,11.3
  pour Bottom (no thermals): 21.1,28.2 21.1,29.3 21,29.4 21,30.8 21.2,31 22.2,31 22.4,30.8 22.4,29.4 22.2,29.2 22.2,28.2
  pour Route15 (rank 5): 20.9,29.3 24.2,26.4 arc-20 27.7,20.6 29.1,14.4 arc-90 24.4,9.7 14.4,9.7 arc-90 8.7,15.4 8.7,18.23 arc-45 9.1,19.2 arc45 9.4,19.92 9.4,20.1 arc90 8.2,21.3 8,21.3 arc90 5.3,18.6 5.3,5.2 10.5,0 24.7,0 33.7,9 33.7,27.5 28.26,27.5 arc-45 25.6,28.6 23.75,30.45 arc45 21.4,31.1 arc101
W
  Top 0.254: U300.10 21.58,8.12 arc48 21.9,7.4 arc7 22.4,7 arc-56 JP1.3